# Altium schematic sheet SubBus4.SchDoc
size A
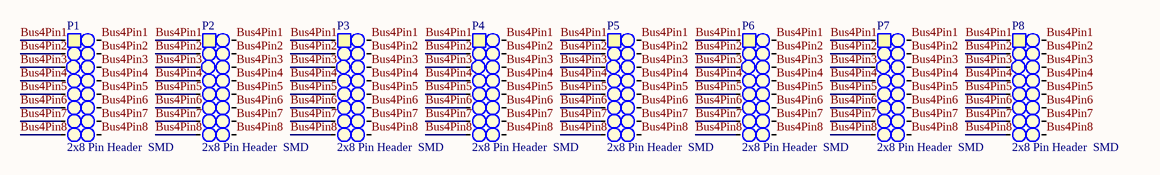
[diagram p0: SubBus4.SchDoc]

## Parts
P1  2x8 Pin Header  SMD  [2X8_SMD_PH_2.54]
P2  2x8 Pin Header  SMD  [2X8_SMD_PH_2.54]
P3  2x8 Pin Header  SMD  [2X8_SMD_PH_2.54]
P4  2x8 Pin Header  SMD  [2X8_SMD_PH_2.54]
P5  2x8 Pin Header  SMD  [2X8_SMD_PH_2.54]
P6  2x8 Pin Header  SMD  [2X8_SMD_PH_2.54]
P7  2x8 Pin Header  SMD  [2X8_SMD_PH_2.54]
P8  2x8 Pin Header  SMD  [2X8_SMD_PH_2.54]

## Nets
Bus4Pin1: P1.1 P1.16 P2.1 P2.16 P3.1 P3.16 P4.1 P4.16 P5.1 P5.16 P6.1 P6.16 P7.1 P7.16 P8.1 P8.16
Bus4Pin2: P1.2 P1.15 P2.2 P2.15 P3.2 P3.15 P4.2 P4.15 P5.2 P5.15 P6.2 P6.15 P7.2 P7.15 P8.2 P8.15
Bus4Pin3: P1.3 P1.14 P2.3 P2.14 P3.3 P3.14 P4.3 P4.14 P5.3 P5.14 P6.3 P6.14 P7.3 P7.14 P8.3 P8.14
Bus4Pin4: P1.4 P1.13 P2.4 P2.13 P3.4 P3.13 P4.4 P4.13 P5.4 P5.13 P6.4 P6.13 P7.4 P7.13 P8.4 P8.13
Bus4Pin5: P1.5 P1.12 P2.5 P2.12 P3.5 P3.12 P4.5 P4.12 P5.5 P5.12 P6.5 P6.12 P7.5 P7.12 P8.5 P8.12
Bus4Pin6: P1.6 P1.11 P2.6 P2.11 P3.6 P3.11 P4.6 P4.11 P5.6 P5.11 P6.6 P6.11 P7.6 P7.11 P8.6 P8.11
Bus4Pin7: P1.7 P1.10 P2.7 P2.10 P3.7 P3.10 P4.7 P4.10 P5.7 P5.10 P6.7 P6.10 P7.7 P7.10 P8.7 P8.10
Bus4Pin8: P1.8 P1.9 P2.8 P2.9 P3.8 P3.9 P4.8 P4.9 P5.8 P5.9 P6.8 P6.9 P7.8 P7.9 P8.8 P8.9

## Library data of the parts
P1-P8 = 2x8 Pin Header  SMD: 2.54mm, SMD; Value: 2x8 Pin Header, 2.54mm, SMD; Farnell: 2356242